# Altium project Wireless_pair.PrjPcb
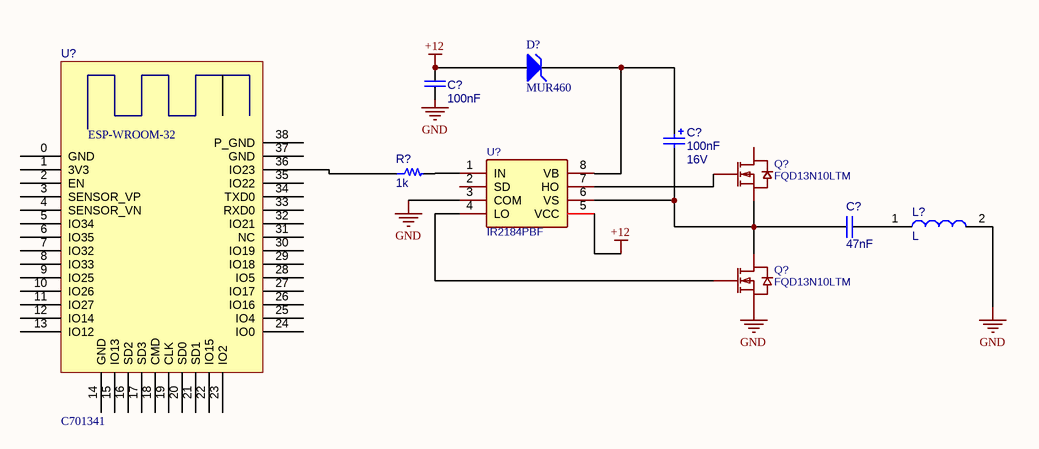
[diagram p0: wp_schematic_v1.SchDoc]
1 sheet, 10 parts. Net scope: global (net labels, ports and power ports of the same name join across sheets).

## Sheet wp_schematic_v1.SchDoc
size A; SheetNumber: 1; SheetTotal: 1

### Parts
(Parts that share a designator on the sheet are numbered #1, #2 ... from top to bottom, then left to right.)
C?#1  100nF  [CAP_0603]
C?#2  Capacitance: 100nF  Voltage - Rated: 16V  [CAP_CERAM]  (hidden comment: 10uF)
C?#3  47nF  [CAP_0603]
D?  Zener Diode  (value not drawn)
L?  L  [IND-SMD_L2.3-W1.7-1]
Q?#1  FQD13N10LTM  [TO-252-2_L6.6-W6.1-P4.57-LS9.9-TL-CW]
Q?#2  FQD13N10LTM  [TO-252-2_L6.6-W6.1-P4.57-LS9.9-TL-CW]
R?  Resistance: 1k  [R0603]  (hidden comment: 182k)
U?#1  IR2184PBF  [SOIC-8_L5.0-W4.0-P1.27-LS6.0-BL]
U?#2  C701341  [ESP32_WROOM]

### Nets
+12: C?#1.1 D?.1(A) U?#1.5(VCC)
GND: C?#1.2 L?.2 U?#1.3(COM)
NetC?#2_1: C?#2.1 D?.2(K) U?#1.8(VB)
NetC?#2_2: C?#2.2 C?#3.1 Q?#1.3(S) Q?#2.2(D) U?#1.6(VS)
NetC?#3_2: C?#3.2 L?.1
NetQ?#1_1: Q?#1.1(G) U?#1.7(HO)
NetQ?#2_1: Q?#2.1(G) U?#1.4(LO)
NetR?_1: R?.1 U?#2.36(IO23)
NetR?_2: R?.2 U?#1.1(IN)

Not connected (* = marked no-connect by the designer): Q?#1 2(D); Q?#2 3(S); U?#1 2(SD); U?#2 0(GND) 1(3V3) 2(EN) 3(SENSOR_VP) 4(SENSOR_VN) 5(IO34) 6(IO35) 7(IO32) 8(IO33) 9(IO25) 10(IO26) 11(IO27) 12(IO14) 13(IO12) 14(GND) 15(IO13) 16(SD2) 17(SD3) 18(CMD) 19(CLK) 20(SD0) 21(SD1) 22(IO15) 23(IO2) 24(IO0) 25(IO4) 26(IO16) 27(IO17) 28(IO5) 29(IO18) 30(IO19) 31(NC) 32(IO21) 33(RXD0) 34(TXD0) 35(IO22) 37(GND) 38(P_GND)

### Notes on the sheet
- Labels drawn without touching a wire or pin: GND
- (in symbol ESP 32) ESP-WROOM-32
- (in symbol Zener Diode) MUR460

### Library data of the parts
C?#1 = CAP - CER 0.1UF 25V X7R 0805: CAP CER 0.1UF 50V X7R 0603; Manufacturer: FH(Guangdong Fenghua Advanced Tech); Manufacturer Part Number: 0603F104M500NT; Pricing 1: 1=0,10000, 10=0,04400, 50=0,02420, 100=0,01980, 500=0,01412, 1000=0,01110 (USD); Case/Package: 0603; Capacitance: 100nF; Voltage Rating: 50V; Voltage: 50V; Length: 1.6mm; Width: 0.031inch; Height: 0.8mm; Thickness: 0.035inch; Depth: 0.8mm; Supplier 1: JLCPCB; Supplier Part Number 1: C42998
C?#2 = Capacitor Polarized: Tantalum Capacitor; Manufacturer: Kemet; Manufacturer Part Number: T491A106K016AT; Manufacturer Size Code: A; Tolerance: ±10%; ESR (Equivalent Series Resistance): 7 Ohm; Type: Molded; Lifetime @ Temp.: 2000 Hrs @ 85°C; Supplier 1: Digi-Key; Supplier Part Number 1: 399-8269-1-ND; RoHS: RoHS Compliant; Category: Capacitors; Stock 1: 46669; Pricing 1: 1=0.41, 10=0.362, 50=0.2198, 100=0.181, 250=0.14476, 500=0.13184, 1000=0.11891 (USD); Packaging: Cut Tape (CT); Operating Temperature: -55°C ~ 125°C; Mounting Type: Surface Mount; Package / Case: 1206 (3216 Metric); Size / Dimension: 0.126" L x 0.063" W (3.20mm x 1.60mm); Height - Seated (Max): 0.071" (1.80mm); Lead Spacing: -; Features: General Purpose; ComponentLink1URL: http://www.kemet.com/Lists/ProductCatalog/Attachments/254/KEM_T2005_T491.pdf; ComponentLink1Description: http://www.kemet.com/Lists/ProductCatalog/Attachments/254/KEM_T2005_T491.pdf
C?#3 = CAP - CER 0.1UF 25V X7R 0805: CAP CER 0.1UF 50V X7R 0603; Manufacturer: FH(Guangdong Fenghua Advanced Tech); Manufacturer Part Number: 0603F104M500NT; Capacitance: 100nF; Pricing 1: 1=0,10000, 10=0,04400, 50=0,02420, 100=0,01980, 500=0,01412, 1000=0,01110 (USD); Case/Package: 0603; Voltage Rating: 50V; Voltage: 50V; Length: 1.6mm; Width: 0.031inch; Height: 0.8mm; Thickness: 0.035inch; Depth: 0.8mm; Supplier 1: JLCPCB; Supplier Part Number 1: C42998
D? = Zener Diode: AF: 1; BV_MAX: 1e99; CJO: 0; EG: 1.11; FC: 0.5; IBV: 0.001; IS: 1e-14; MJSW: 0.33; NTUN: 30; TNOM: 27; XTI: 3; SimulationGenericComponent: True; CJP: 0; CTA: 0; CTP: 0; FCS: 0.5; FV_MAX: 1e99; IKF: 0; IKR: 0; ISR: 1e-14; JSW: 0; JTUN: 0; JTUNSW: 0; KEG: 1; KF: 0; LEVEL: 1; N: 1; NBV: 1; NR: 1; NS: 1; PHP: 1; RS: 0; TCV: 0; TLEV: 0; TLEVC: 0; TM1: 0; TM2: 0; TPB: 0; TPHP: 0; TRS: 0; TRS2: 0; TT: 0; TTT1: 0; TTT2: 0; VJ: 1; XTITUN: 3
L? = L: C393989
Q?#1 Q?#2 = FQD13N10LTM: BOM_Manufacturer: FAIRCHILD; BOM_Supplier: LCSC; BOM_Manufacturer Part: FQD13N10LTM; BOM_Supplier Part: C37552; BOM_JLCPCB Part Class: Extended Part; spicePre: Q; spiceSymbolName: FQD13N10LTM
R? = Res 1k ±1% 0.063W 0402: Manufacturer: UNI-ROYAL(Uniroyal Elec); Manufacturer Part Number: 0603WAJ0472T5E; ComponentLink1URL: https://lcsc.com/product-detail/Chip-Resistor-Surface-Mount_Resistor-Today-AECR0402F1K00K9_C328304.html; Supplier 1: JLCPCB; Package / Case: 0603; Supplier Part Number 1: C25999
U?#1 = IR2184PBF: BOM_Manufacturer: TI; BOM_Manufacturer Part: TPS54331DR; BOM_Supplier: LCSC; BOM_Supplier Part: C9865; BOM_JLCPCB Part Class: Basic Part; spicePre: U; spiceSymbolName: TPS54331DR
U?#2 = ESP 32